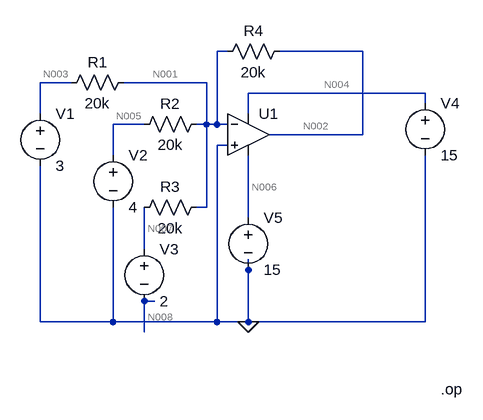
[diagram p0: schematic Draft4.asc]
Draft4.asc, the LTspice schematic file:
Version 4
SHEET 1 880 1012
WIRE 256 -16 240 -16
WIRE 464 -16 336 -16
WIRE 16 32 -32 32
WIRE 224 32 96 32
WIRE 560 48 288 48
WIRE 560 64 560 48
WIRE -32 80 -32 32
WIRE 288 80 288 48
WIRE 128 96 80 96
WIRE 224 96 224 32
WIRE 224 96 208 96
WIRE 240 96 240 -16
WIRE 240 96 224 96
WIRE 256 96 240 96
WIRE 464 112 464 -16
WIRE 464 112 320 112
WIRE 256 128 240 128
WIRE 80 144 80 96
WIRE 224 224 224 96
WIRE 224 224 208 224
WIRE 288 240 288 144
WIRE 128 288 128 224
WIRE 288 320 288 304
WIRE 144 368 128 368
WIRE -32 400 -32 160
WIRE 80 400 80 224
WIRE 80 400 -32 400
WIRE 240 400 240 128
WIRE 240 400 80 400
WIRE 288 400 288 320
WIRE 288 400 240 400
WIRE 560 400 560 144
WIRE 560 400 288 400
WIRE 128 416 128 368
FLAG 288 400 0
SYMBOL voltage -32 64 R0
SYMATTR InstName V1
SYMATTR Value 3
SYMBOL voltage 80 128 R0
SYMATTR InstName V2
SYMATTR Value 4
SYMBOL voltage 128 272 R0
SYMATTR InstName V3
SYMATTR Value 2
SYMBOL res 112 16 R90
WINDOW 0 0 56 VBottom 2
WINDOW 3 32 56 VTop 2
SYMATTR InstName R1
SYMATTR Value 20k
SYMBOL res 224 80 R90
WINDOW 0 0 56 VBottom 2
WINDOW 3 32 56 VTop 2
SYMATTR InstName R2
SYMATTR Value 20k
SYMBOL res 224 208 R90
WINDOW 0 0 56 VBottom 2
WINDOW 3 32 56 VTop 2
SYMATTR InstName R3
SYMATTR Value 20k
SYMBOL res 352 -32 R90
WINDOW 0 0 56 VBottom 2
WINDOW 3 32 56 VTop 2
SYMATTR InstName R4
SYMATTR Value 20k
SYMBOL voltage 560 48 R0
SYMATTR InstName V4
SYMATTR Value 15
SYMBOL voltage 288 224 R0
SYMATTR InstName V5
SYMATTR Value 15
SYMBOL OpAmps\\UniversalOpAmp 288 112 R0
SYMATTR InstName U1
TEXT 584 504 Left 2 !.op

The netlist it stands for:
* Draft4.asc
V1 N003 0 3
V2 N005 0 4
V3 N007 N008 2
R1 N001 N003 20k
R2 N001 N005 20k
R3 N001 N007 20k
R4 N002 N001 20k
V4 N004 0 15
V5 N006 0 15
XU1 0 N001 N004 N006 N002 level1 Avol=1Meg GBW=10Meg Vos=0 En=0 Enk=0 In=0 Ink=0 Rin=500Meg  ; pins In+ In- V+ V- OUT
.op
.lib UniversalOpAmp1.lib
.backanno
.end

* Results of the author's LTspice run, read from the files saved beside the schematic
* Operating Point:
*   V(n003) = 3 V
*   V(n005) = 4 V
*   V(n007) = 7.001 µV
*   V(n008) = -2 V
*   V(n001) = 7.001 µV
*   V(n002) = -7.001 V
*   V(n004) = 15 V
*   V(n006) = 15 V
*   I(R1) = -150 µA
*   I(R2) = -200 µA
*   I(R3) = 0 A
*   I(R4) = -350 µA
*   I(V1) = -150 µA
*   I(V2) = -200 µA
*   I(V3) = 0 A
*   I(V4) = -30 nA
*   I(V5) = -30 nA
*   Ix(u1:1) = -30 nA
*   Ix(u1:2) = -30 nA
*   Ix(u1:3) = 30 nA
*   Ix(u1:4) = 30 nA
*   Ix(u1:5) = 350 µA